# Altium schematic sheet Sender_CH1.SchDoc
size A4
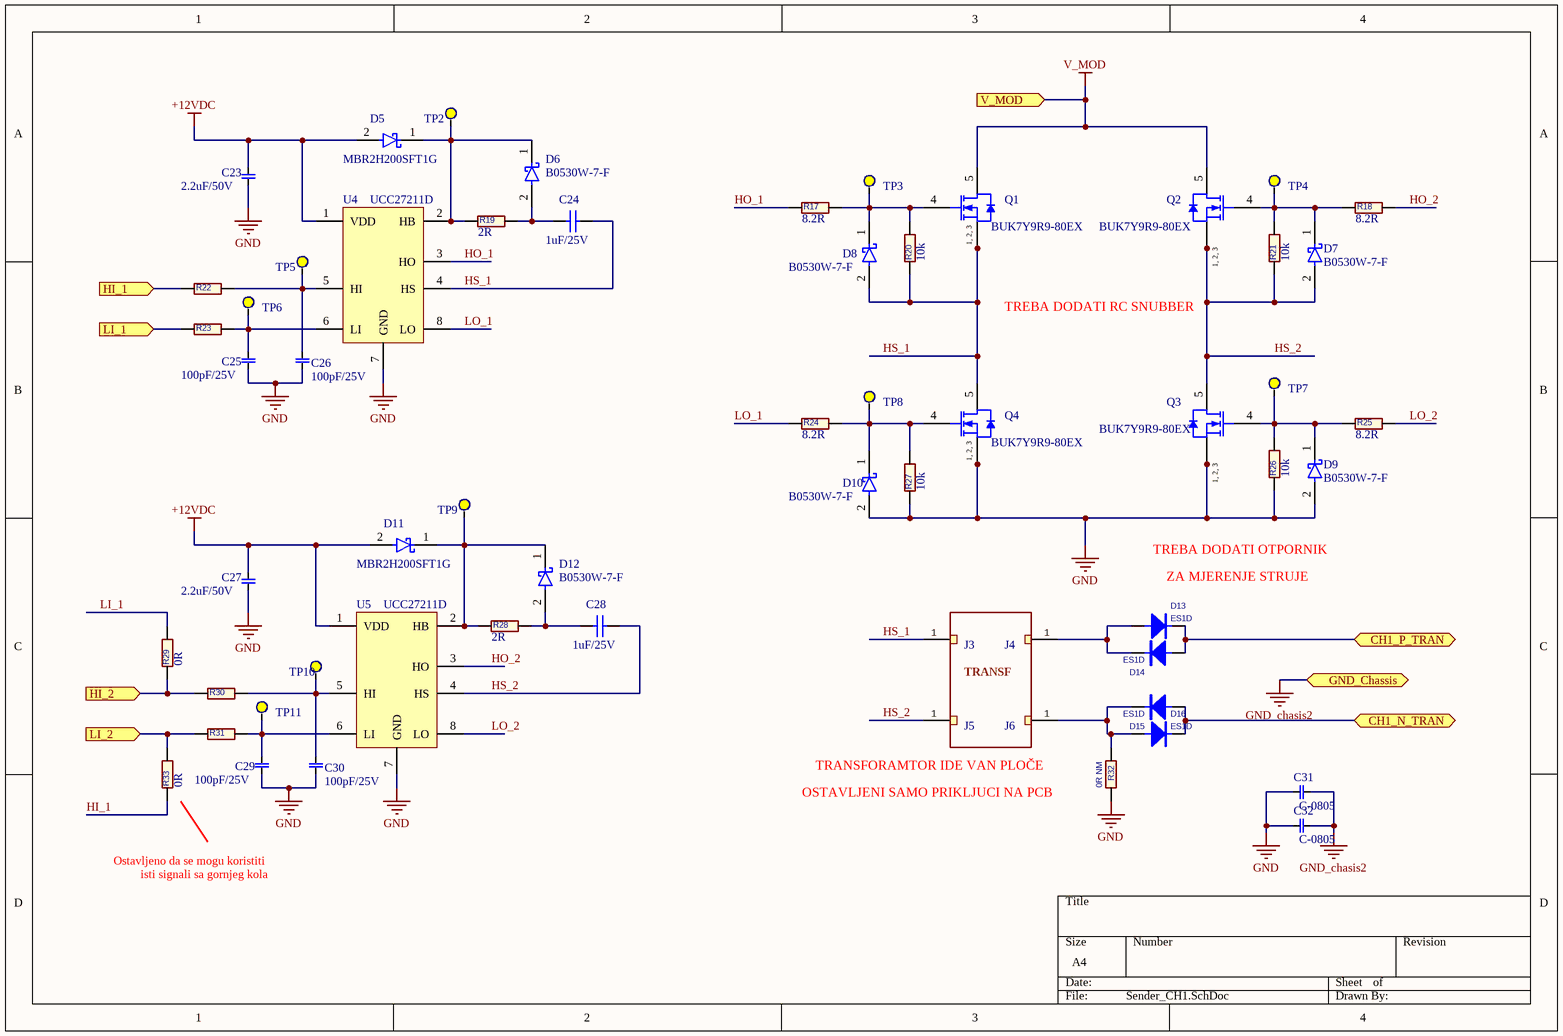
[diagram p0: Sender_CH1.SchDoc]

## Parts
C23  2.2uF/50V  [FP-CL31-IPC_B]
C24  1uF/25V  [CAPC2013X70X45LL10T25]
C25  100pF/25V  [C-0603]
C26  100pF/25V  [C-0603]
C27  2.2uF/50V  [FP-CL31-IPC_B]
C28  1uF/25V  [CAPC2013X70X45LL10T25]
C29  100pF/25V  [C-0603]
C30  100pF/25V  [C-0603]
C31  C-0805  [C-0805]
C32  C-0805  [C-0805]
D5  MBR2H200SFT1G  [FP-498-MFG]
D6  B0530W-7-F  [FP-SOD123-IPC_B]
D7  B0530W-7-F  [FP-SOD123-IPC_B]
D8  B0530W-7-F  [FP-SOD123-IPC_B]
D9  B0530W-7-F  [FP-SOD123-IPC_B]
D10  B0530W-7-F  [FP-SOD123-IPC_B]
D11  MBR2H200SFT1G  [FP-498-MFG]
D12  B0530W-7-F  [FP-SOD123-IPC_B]
D13  ES1D  [SMA]
D14  ES1D  [SMA]
D15  ES1D  [SMA]
D16  ES1D  [SMA]
J3  CON1_b  [CONN1 _b]  (value not drawn)
J4  CON1_b  [CONN1 _b]  (value not drawn)
J5  CON1_b  [CONN1 _b]  (value not drawn)
J6  CON1_b  [CONN1 _b]  (value not drawn)
Q1  BUK7Y9R9-80EX  [NXP-SOT669_N]
Q2  BUK7Y9R9-80EX  [NXP-SOT669_N]
Q3  BUK7Y9R9-80EX  [NXP-SOT669_N]
Q4  BUK7Y9R9-80EX  [NXP-SOT669_N]
R17  8.2R  [RES-0805]
R18  8.2R  [RES-0805]
R19  2R  [RESC3216X60X45NL10T20]
R20  10k  [R-0603]
R21  10k  [R-0603]
R22  1k  [R-0603]  (value not drawn)
R23  1k  [R-0603]  (value not drawn)
R24  8.2R  [RES-0805]
R25  8.2R  [RES-0805]
R26  10k  [R-0603]
R27  10k  [R-0603]
R28  2R  [RESC3216X60X45NL10T20]
R29  0R  [RES-0805]
R30  1k  [R-0603]  (value not drawn)
R31  1k  [R-0603]  (value not drawn)
R32  0R NM  [RES-0805]
R33  0R  [RES-0805]
TP2  Test_Point  [Test_Point]  (value not drawn)
TP3  Test_Point  [Test_Point]  (value not drawn)
TP4  Test_Point  [Test_Point]  (value not drawn)
TP5  Test_Point  [Test_Point]  (value not drawn)
TP6  Test_Point  [Test_Point]  (value not drawn)
TP7  Test_Point  [Test_Point]  (value not drawn)
TP8  Test_Point  [Test_Point]  (value not drawn)
TP9  Test_Point  [Test_Point]  (value not drawn)
TP10  Test_Point  [Test_Point]  (value not drawn)
TP11  Test_Point  [Test_Point]  (value not drawn)
U4  UCC27211D  [D-8 PIN 1.27pitch]
U5  UCC27211D  [D-8 PIN 1.27pitch]

## Blocks framed on the sheet
TRANSF: J3 J5

## Ports
CH1_N_TRAN (bidir), CH1_P_TRAN (bidir), GND_Chassis (bidir), HI_1 (in), HI_2 (in), LI_1 (in), LI_2 (in), V_MOD (in)

## Nets
+12VDC: C23.2(G) C27.2(G) D5.2(A) D11.2(A) U4.1(VDD) U5.1(VDD)
GND: C23.1(G) C25.1(G) C26.1(G) C27.1(G) C29.1(G) C30.1(G) C31.1(G) C32.1(G) D9.2(A) D10.2(A) Q3.1(S) Q3.2(S) Q3.3(S) Q4.1(S) Q4.2(S) Q4.3(S) R26.1 R27.1 R32.1 U4.7(GND) U5.7(GND)
GND_chasis2: C31.2(G) C32.2(G) ; port GND_Chassis
V_MOD: Q1.5(D) Q2.5(D) ; port V_MOD
CH1_N_TRAN: D15.1(A) D16.2(C) ; port CH1_N_TRAN
CH1_P_TRAN: D13.2(C) D14.1(A) ; port CH1_P_TRAN
HI_1: R22.1 ; port HI_1
HI_1: R33.1  [a separate net that carries the same name]
HI_2: R29.1 R30.1 ; port HI_2
HO_1: R17.1 U4.3(HO)
HO_2: R18.2 U5.3(HO)
HS_1: C24.2 D8.2(A) J3.1 Q1.1(S) Q1.2(S) Q1.3(S) Q4.5(D) R20.1 U4.4(HS)
HS_2: C28.2 D7.2(A) J5.1 Q2.1(S) Q2.2(S) Q2.3(S) Q3.5(D) R21.1 U5.4(HS)
LI_1: R23.1 ; port LI_1
LI_1: R29.2  [a separate net that carries the same name]
LI_2: R31.1 R33.2 ; port LI_2
LO_1: R24.1 U4.8(LO)
LO_2: R25.2 U5.8(LO)
NetC24_1: C24.1 D6.2(A) R19.2
NetC25_2: C25.2(G) R23.2 TP6.1 U4.6(LI)
NetC26_2: C26.2(G) R22.2 TP5.1 U4.5(HI)
NetC28_1: C28.1 D12.2(A) R28.2
NetC29_2: C29.2(G) R31.2 TP11.1 U5.6(LI)
NetC30_2: C30.2(G) R30.2 TP10.1 U5.5(HI)
NetD5_1: D5.1(C) D6.1(C) R19.1 TP2.1 U4.2(HB)
NetD7_1: D7.1(C) Q2.4(G) R18.1 R21.2 TP4.1
NetD8_1: D8.1(C) Q1.4(G) R17.2 R20.2 TP3.1
NetD9_1: D9.1(C) Q3.4(G) R25.1 R26.2 TP7.1
NetD10_1: D10.1(C) Q4.4(G) R24.2 R27.2 TP8.1
NetD11_1: D11.1(C) D12.1(C) R28.1 TP9.1 U5.2(HB)
NetD13_1: D13.1(A) D14.2(C) J4.1
NetD15_2: D15.2(C) D16.1(A) J6.1 R32.2

## Notes on the sheet
- TREBA DODATI RC SNUBBER
- TREBA DODATI OTPORNIK
- (near D13) ZA MJERENJE STRUJE
- TRANSFORAMTOR IDE VAN PLOČE
- OSTAVLJENI SAMO PRIKLJUCI NA PCB
- Ostavljeno da se mogu koristiti
- isti signali sa gornjeg kola
- (in symbol BUK7Y9R9-80EX) 1, 2, 3

## Library data of the parts
C23 C27 = CL31B225KBHVPNE: Cap Ceramic 2.2uF 50V X7R ±10% SMD 1206 +125°C Embossed T/R; Width: 0.063inch; Case/Package: 1206; Tolerance: 10%; Mount: Surface Mount; Capacitance: 2.2uF; Ratings: AEC-Q200; Thickness: 0.071inch; Voltage Rating: 50V; Features: Soft Termination; Case Code (Metric): 3216; Length: 0.126inch; Packaging: Tape and Reel; Max Operating Temperature: 125°C; Min Operating Temperature: -55°C; Case Code (Imperial): 1206; Dielectric: X7R
C24 C28 = GRM216R61E105KA12D: 1µF ±10% 25V Ceramic Capacitor X5R 0805 (2012 Metric); Manufacturer: Murata; Part Number: GRM216R61E105KA12D
C25 C26 C29 C30 = C0201C101J3GACTU: 100pF ±5% 25V Ceramic Capacitor C0G, NP0 0201 (0603 Metric); Manufacturer: KEMET; Capacitance: 100pF; Case Code (Imperial): 0201; Case Code (Metric): 0603; Case/Package: 0201; Category: Ceramic Capacitors; Construction: Flat; Depth: 0.3mm; Dielectric: C0G; Height: 0.3mm; Length: 0.6mm; Manufacturer Part Number: C0201C101J3GACTU; Max Operating Temperature: 125°C; Min Operating Temperature: -55°C; Mount: Surface Mount; Package Quantity: 1; Packaging: Tape and Reel; Radiation Hardening: No; RoHS Compliant: Yes; Series: C; Thickness: 0.013inch; Tolerance: 5%; Voltage: 25V; Voltage Rating: 25V; Width: 0.3mm; ComponentLink1URL: https://datasheet.ciiva.com/25795/cl31b106kahnnne-25795260.pdf?src-supplier=Digi-Key; ComponentLink1Description: https://datasheet.ciiva.com/25795/cl31b106kahnnne-25795260.pdf?src-supplier=Digi-Key; Contact Plating: Tin,Matte; REACH SVHC: No SVHC; Termination: SMD/SMT; Voltage Rating (DC): 25V; Weight: 6E-06oz
C31 C32 = C-0805: Manufacturer 1: Yageo; Manufacturer Part Number 1: CC1206KKX7RBBB332; Tolerance: ±10%; Voltage - Rated: 500V; Temperature Coefficient: X7R; Notification: Current market demand for these product types have resulted in fluctuating and extending lead times. Lead times may differ.; Description 1: CAP CER 3300PF 500V X7R 1206; Category 1: Capacitors; Packaging: Cut Tape (CT); Part Status: Active; Operating Temperature: -55°C ~ 125°C; Features: -; Ratings: -; Applications: General Purpose; Failure Rate: -; Mounting Type: Surface Mount, MLCC; Package / Case: 1206 (3216 Metric); Size / Dimension: 0.126" L x 0.063" W (3.20mm x 1.60mm); Height - Seated (Max): -; Thickness (Max): 0.057" (1.45mm); Lead Spacing: -; Lead Style: -; ComponentLink1URL: http://www.yageo.com/documents/recent/UPY-NP0X7R_MV_100-to-630V_21.pdf; ComponentLink1Description: http://www.yageo.com/documents/recent/UPY-NP0X7R_MV_100-to-630V_21.pdf; Supplier 1: Digi-Key; Supplier Part Number 1: 311-1506-1-ND; RoHS 1: RoHS Compliant; Stock 1: 4928; Pricing 1: 1=0.31, 10=0.214, 100=0.1085, 500=0.07424, 1000=0.06568 (USD)
D5 D11 = MBR2H200SFT1G: DIODE SCHOTTKY 200V 2A SOD123FL; Manufacturer: ON Semiconductor; Peak Reverse Current: 200uA; Max Surge Forward Current: 30A; Max Junction Temp: +150°C; Standoff Height: 0mm; Device Class L1: Discrete Semiconductors; Package: 498; Temperature Range High: +150°C; Height: 0.98mm; Temperature: -55°C to +150°C; Forward Current: 2A; Octopart: https://octopart.com/mbr2h200sft1g-on+semiconductor-51167333; Reverse Voltage: 200V; Max Repetitive Reverse Voltage: 200V; RoHS: TRUE; Lead Free: Yes; Footprint Url: https://www.onsemi.com/pub/Collateral/498-01.PDF; ComponentLink2Description: Datasheet; Category: Diode; Manufacturer Part Number: MBR2H200SFT1G; Digikey Description: DIODE SCHOTTKY 200V 2A SOD123FL; Device Class L3: Schottky Diodes; Temperature Range Low: -55°C; ComponentLink2URL: https://www.onsemi.com/pub/Collateral/MBR2H200SF-D.PDF; Automotive: No; Device Class L2: Diodes
D6-D10 D12 = B0530W-7-F: DIODE SCHOTTKY 30V 500MA SOD123; Manufacturer: Diodes Inc.; Max Surge Forward Current: 5.5A; Forward Current: 0.5A; Max Junction Temp: +125°C; Standoff Height: 0mm; Capacitance: 170pF; Value: 170pF; Peak Reverse Current: 130uA; Footprint Url: https://www.diodes.com/assets/Package-Files/SOD123.pdf; Device Class L1: Discrete Semiconductors; ComponentLink2Description: Datasheet; Mouser Description: Schottky Diodes & Rectifiers 30V 410mW; Device Class L3: Schottky Diodes; Package: SOD123; Temperature: -65°C to +125°C; Temperature Range Low: -65°C; Lead Free: Yes; Digikey Description: DIODE SCHOTTKY 30V 500MA SOD123; Ipc Land Pattern Name: SOD365155X123-2; Automotive: No; Octopart: https://octopart.com/b0530w-7-f-diodes+inc.-325721; Device Class L2: Diodes; ComponentLink2URL: https://www.diodes.com/assets/Datasheets/ds30139.pdf; RoHS: TRUE; Height: 1.45mm; Max Repetitive Reverse Voltage: 30V; Category: Diode; Temperature Range High: +125°C; Manufacturer Part Number: B0530W-7-F; Reverse Voltage: 30V
D13-D16 = ES1x: Diode; Manufacturer: Fairchild/ON Semiconductor; Diode Type: Standard; Voltage - DC Reverse (Vr) (Max): 200V; Current - Average Rectified (Io): 1A; Voltage - Forward (Vf) (Max) @ If: 920mV @ 1A; Speed: Fast Recovery =< 500ns, > 200mA (Io); Reverse Recovery Time (trr): 15ns; Current - Reverse Leakage @ Vr: 5μA @ 200V; Capacitance @ Vr, F: 7pF @ 4V, 1MHz; Supplier 1: Digi-Key; Supplier Part Number 1: ES1DFSTR-ND; Manufacturer Part Number: ES1D; RoHS: RoHS Compliant; Category: Discrete Semiconductor Products; Stock 1: 135000; Pricing 1: 7500=0.0567, 15000=0.0504, 37500=0.04725, 52500=0.0419, 187500=0.04032 (USD); Packaging: Tape & Reel (TR); Part Status: Active; Mounting Type: Surface Mount; Package / Case: DO-214AC, SMA; Supplier Device Package: SMA (DO-214AC); Operating Temperature - Junction: -55°C ~ 150°C; ComponentLink1URL: https://www.fairchildsemi.com/datasheets/ES/ES1A.pdf; ComponentLink1Description: https://www.fairchildsemi.com/datasheets/ES/ES1A.pdf
Q1-Q4 = BUK7Y9R9-80EX: N-Channel 80V 89A (Tc) 195W (Tc) Surface Mount LFPAK56, Power-SO8; Manufacturer: Nexperia; Category: MOSFETs; Manufacturer Part Number: BUK7Y9R9-80EX; RoHS Compliant: No; ComponentLink1URL: https://assets.nexperia.com/documents/data-sheet/BUK7Y9R9-80E.pdf?src-supplier=Digi-Key; ComponentLink1Description: https://assets.nexperia.com/documents/data-sheet/BUK7Y9R9-80E.pdf?src-supplier=Digi-Key
R17 R18 R24 R25 = CRCW08058R20JNEA: 8.2 Ohms ±5% 0.125W, 1/8W Chip Resistor 0805 (2012 Metric) Automotive AEC-Q200 Thick Film; Manufacturer: Vishay Dale; Max Power Dissipation: 125mW; Temperature Coefficient: 200ppm/°C; Voltage Rating: 150V; Case Code (Imperial): 0805; Case Code (Metric): 2012; Case/Package: 0805; Category: Chip SMD Resistors; Construction: Rectangular; Contact Plating: Tin; Depth: 1.25mm; Features: Automotive AEC-Q200; Height: 0.02inch; Lead Free: Lead Free; Length: 2mm; Manufacturer Part Number: CRCW08058R20JNEA; Max Operating Temperature: 155°C; Military Standard: Not; Min Operating Temperature: -55°C; Mount: Surface Mount; Number of Pins: 2; Number of Terminations: 2; Package Quantity: 1; Packaging: Tape and Reel; Power Rating: 125mW; Radiation Hardening: No; REACH SVHC: Unknown; Resistance: 8.2R; Resistance Tolerance: 5%; Resistor Type: Thick Film; RoHS Compliant: Yes; Series: CRCW; Size Code: 0805; Tolerance: 5%; Voltage Rating (DC): 150V; Weight: 0.000194oz; Width: 1.25mm; ComponentLink1URL: https://datasheet.ciiva.com/2512/dcrcwe3-2512297.pdf?src-supplier=Digi-Key; ComponentLink1Description: https://datasheet.ciiva.com/2512/dcrcwe3-2512297.pdf?src-supplier=Digi-Key
R19 R28 = CRCW12062R00FKEA: 2 Ohms ±1% 0.25W, 1/4W Chip Resistor 1206 (3216 Metric) Automotive AEC-Q200 Thick Film; Manufacturer: Vishay Dale; Max Power Dissipation: 250mW; Temperature Coefficient: 100ppm/°C; Voltage Rating: 200V; Case Code (Imperial): 1206; Case Code (Metric): 3216; Case/Package: 1206; Category: Chip SMD Resistors; Construction: Rectangular; Contact Plating: Tin; Depth: 1.6mm; Features: Automotive AEC-Q200; Height: 0.024inch; Lead Free: Lead Free; Length: 3.2mm; Manufacturer Part Number: CRCW12062R00FKEA; Max Operating Temperature: 155°C; Military Standard: Not; Min Operating Temperature: -55°C; Number of Pins: 2; Number of Terminations: 2; Package Quantity: 10; Packaging: Tape and Reel; Power Rating: 250mW; Radiation Hardening: No; REACH SVHC: Unknown; Resistance: 2R; Resistance Tolerance: 1%; Resistor Type: Thick Film; RoHS Compliant: Yes; Series: CRCW; Termination: SMD/SMT; Tolerance: 1%; Voltage Rating (DC): 200V; Weight: 0.000353oz; Width: 1.6mm; ComponentLink1URL: https://datasheet.ciiva.com/2469/dcrcwe3-2469237.pdf?src-supplier=Digi-Key; ComponentLink1Description: https://datasheet.ciiva.com/2469/dcrcwe3-2469237.pdf?src-supplier=Digi-Key
R20 R21 R26 R27 = RR0816P-103-D: 10 kOhms ±0.5% 0.063W, 1/16W Chip Resistor 0603 (1608 Metric)  Thin Film; Manufacturer: Susumu; Max Power Dissipation: 63mW; Resistance: 10kR; Temperature Coefficient: 25ppm/°C; Voltage Rating: 75V; Width: 0.8mm; Case Code (Imperial): 0603; Case Code (Metric): 1608; Case/Package: 0603; Category: Chip SMD Resistors; Depth: 0.8mm; Height: 0.4mm; Lead Free: Lead Free; Length: 1.6mm; Manufacturer Part Number: RR0816P-103-D; Max Operating Temperature: 125°C; Min Operating Temperature: -55°C; Number of Pins: 2; Number of Terminations: 2; Package Quantity: 1; Packaging: Tape and Reel; Power Rating: 63mW; REACH SVHC: Unknown; Resistance Tolerance: 0.5%; Resistor Type: Thin Film; RoHS Compliant: Yes; Series: RR; Size Code: 0603; Technology: THIN FILM; Termination: SMD/SMT; Tolerance: 0.5%; Voltage Rating (DC): 75V; Weight: 7.1E-05oz
R22 R23 R30 R31 = RR0816P-102-D: 1 kOhms ±0.5% 0.063W, 1/16W Chip Resistor 0603 (1608 Metric)  Thin Film; Manufacturer: Susumu; Max Power Dissipation: 63mW; Resistance: 1kR; Temperature Coefficient: 25ppm/°C; Voltage Rating: 75V; Width: 0.031inch; Case Code (Imperial): 0603; Case Code (Metric): 1608; Case/Package: 0603; Category: Chip SMD Resistors; Depth: 0.8mm; Height: 0.4mm; Lead Free: Lead Free; Length: 1.6mm; Manufacturer Part Number: RR0816P-102-D; Max Operating Temperature: 125°C; Min Operating Temperature: -55°C; Number of Pins: 2; Number of Terminations: 2; Package Quantity: 1; Packaging: Tape and Reel; Power Rating: 63mW; REACH SVHC: Unknown; Resistance Tolerance: 0.5%; Resistor Type: Thin Film; RoHS Compliant: Yes; Series: RR; Size Code: 0603; Technology: THIN FILM; Termination: SMD/SMT; Tolerance: 0.5%; Voltage Rating (DC): 75V; ComponentLink1URL: https://datasheet.ciiva.com/2487/rr-data-sheet-2487025.pdf?src-supplier=Digi-Key; ComponentLink1Description: https://datasheet.ciiva.com/2487/rr-data-sheet-2487025.pdf?src-supplier=Digi-Key
R29 R33 = RC0805JR-070RL: 0 Ohms Jumper 0.125W, 1/8W Chip Resistor 0805 (2012 Metric) Moisture Resistant Thick Film
R32 = CRCW0805xxxxJN Default: RES xx OHM 1/8W 5% 0805 SMD; Category 1: Resistors
U4 U5 = UCC27211D: Half-Bridge Gate Driver IC Non-Inverting 8-SOIC; Manufacturer: Texas Instruments; Fall Time: 400ns; Max Output Current: 4A; Max Supply Current: 4.3mA; Max Supply Voltage: 17V; Min Supply Voltage: 8V; Number of Channels: 2; Operating Supply Voltage: 12V; Propagation Delay: 40ns; Rise Time: 600ns; Case/Package: SOIC; Category: Gate Drivers; Height: 1.5mm; Lead Free: Lead Free; Length: 5mm; Manufacturer Part Number: UCC27211D; Max Operating Temperature: 140°C; Min Operating Temperature: -40°C; Mount: Surface Mount; Nominal Supply Current: 4A; Number of Drivers: 2; Number of Outputs: 2; Number of Pins: 8; Output Current: 4A; Package Quantity: 75; Packaging: Rail/Tube; Radiation Hardening: No; REACH SVHC: No SVHC; RoHS Compliant: Yes; Series: -; Supply Current: 4A; Turn-On Delay Time: 40ns; Width: 4mm; ComponentLink1URL: https://datasheet.ciiva.com/1951/ucc27210-1951181.pdf?src-supplier=Digi-Key; ComponentLink1Description: https://datasheet.ciiva.com/1951/ucc27210-1951181.pdf?src-supplier=Digi-Key